# Altium schematic sheet ADC-Bessel-LPF.SchDoc: Bessel LPF / AAF (350kHz / 14dB)
size A4; Date: 06.10.2023; ApprovedBy: M.Sc. Tobias Wirth; CheckedBy: M.Sc. Tobias Wirth; Author: M.Sc. Tobias Wirth; CompanyName: University of Stuttgart; DrawnBy: M.Sc. Tobias Wirth; Engineer: M.Sc. Tobias Wirth; Organization: IIS; Address1: Pfaffenwaldring 47; Address2: 70569 Stuttgart; Revision: V1.3; SheetNumber: 11; SheetTotal: 17; ProjectNameAlt: AUS - NMR System; Time: 15:00; ImagePath: N/A; Application_BuildNumber: N/A
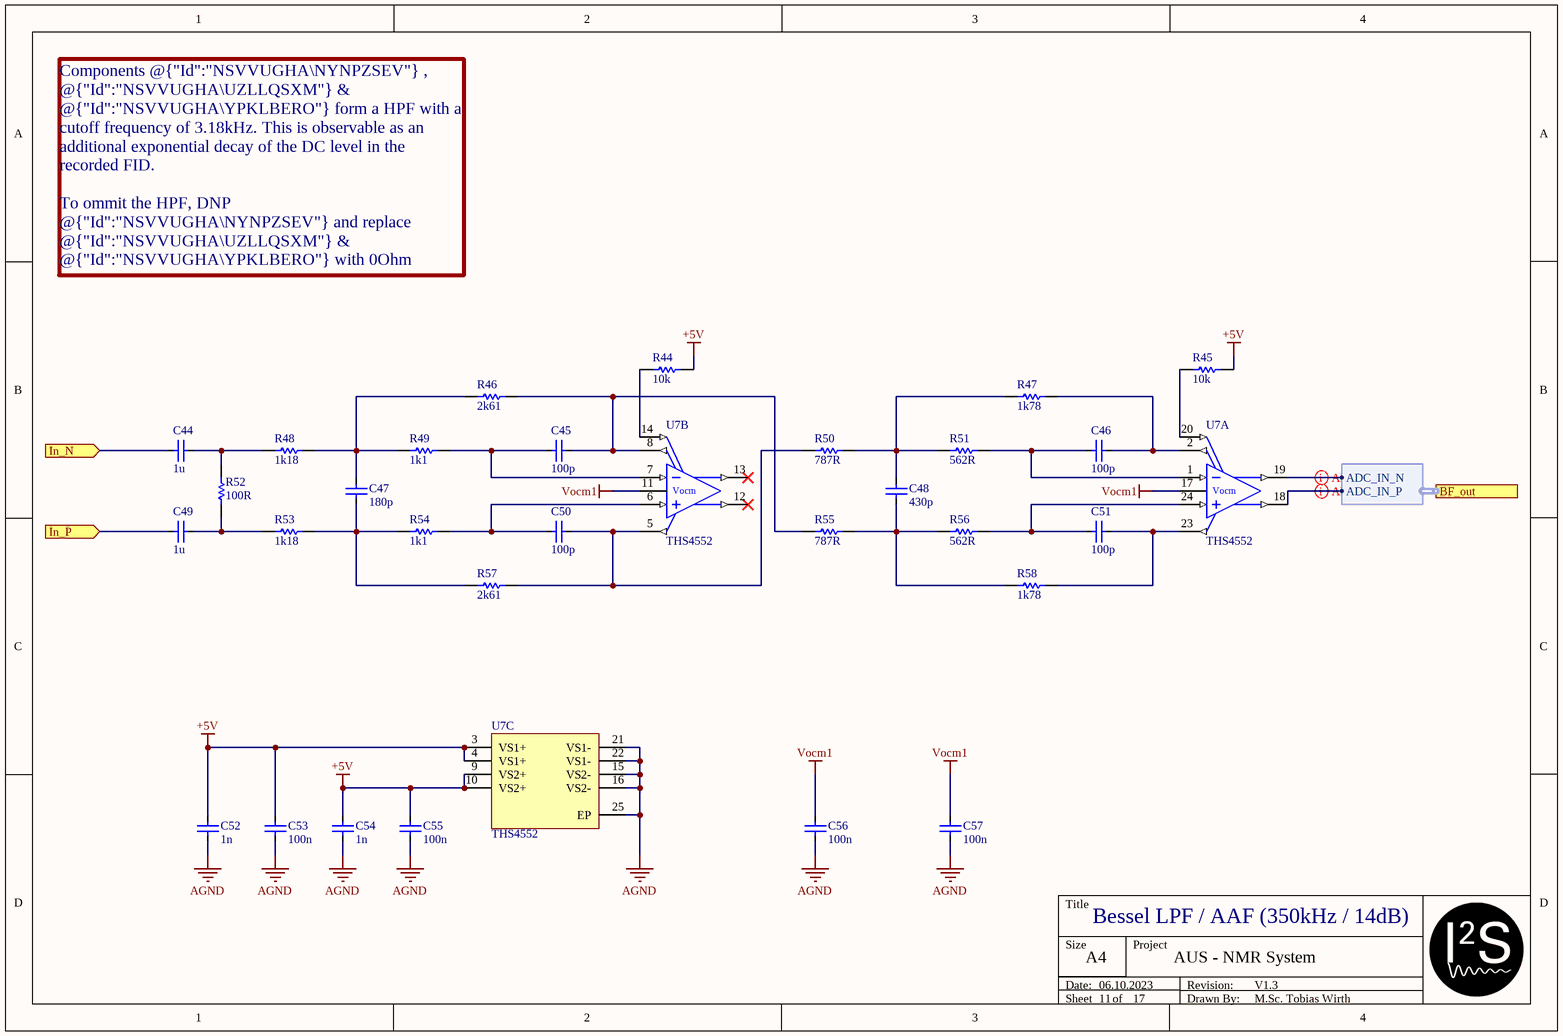
[diagram p0: ADC-Bessel-LPF.SchDoc]

## Parts
C44  1u  [CAP_0402]
C45  100p  [CAP_0402]
C46  100p  [CAP_0402]
C47  180p  [CAP_0402]
C48  430p  [CAP_0402]
C49  1u  [CAP_0402]
C50  100p  [CAP_0402]
C51  100p  [CAP_0402]
C52  1n  [CAP_0402]
C53  100n  [CAP_0402]
C54  1n  [CAP_0402]
C55  100n  [CAP_0402]
C56  100n  [CAP_0402]
C57  100n  [CAP_0402]
R44  10k  [RES_0402]
R45  10k  [RES_0402]
R46  2k61  [RES_0402]
R47  1k78  [RES_0402]
R48  1k18  [RES_0402]
R49  1k1  [RES_0402]
R50  787R  [RES_0402]
R51  562R  [RES_0402]
R52  100R  [RES_0402]
R53  1k18  [RES_0402]
R54  1k1  [RES_0402]
R55  787R  [RES_0402]
R56  562R  [RES_0402]
R57  2k61  [RES_0402]
R58  1k78  [RES_0402]
U7  THS4552  [QFN-24Pin_TP]  (parts A,B,C of 3)

## Ports
BF_out (harness ADC_IN), In_N (in), In_P (in)

## Harnesses
ADC_IN: ADC_IN_N, ADC_IN_P

## Nets
+5V: C52.1 C53.1 C54.1 C55.1 R44.2 R45.2 U7.3(VS1+) U7.4(VS1+) U7.9(VS2+) U7.10(VS2+)
AGND: C52.2 C53.2 C54.2 C55.2 C56.2 C57.2 U7.15(VS2-) U7.16(VS2-) U7.21(VS1-) U7.22(VS1-) U7.25(EP)
Vocm1: C56.1 C57.1 U7.11(VOCM2) U7.17(VOCM1)
In_N: C44.1 ; port In_N
In_P: C49.1 ; port In_P
NetC44_2: C44.2 R48.1 R52.2
NetC45_1: C45.1 R46.2 R55.1 U7.8(FB2+)
NetC45_2: C45.2 R49.2 U7.7(IN2-)
NetC46_1: C46.1 R47.2 U7.2(FB1+)
NetC46_2: C46.2 R51.2 U7.1(IN1-)
NetC47_1: C47.1 R46.1 R48.2 R49.1
NetC47_2: C47.2 R53.2 R54.1 R57.1
NetC48_1: C48.1 R47.1 R50.2 R51.1
NetC48_2: C48.2 R55.2 R56.1 R58.1
NetC49_2: C49.2 R52.1 R53.1
NetC50_1: C50.1 R50.1 R57.2 U7.5(FB2-)
NetC50_2: C50.2 R54.2 U7.6(IN2+)
NetC51_1: C51.1 R58.2 U7.23(FB1-)
NetC51_2: C51.2 R56.2 U7.24(IN1+)
NetR44_1: R44.1 U7.14(~{PD2})
NetR45_1: R45.1 U7.20(~{PD1})
NetU7_18: U7.18(OUT1+) ; port BF_out.ADC_IN_P
NetU7_19: U7.19(OUT1-) ; port BF_out.ADC_IN_N

Not connected (* = marked no-connect by the designer): U7 12(OUT2+)* 13(OUT2-)*

## Layout directives
differential pair; net class ADC_A_IN: NetU7_18, NetU7_19

## Notes on the sheet
- Components @{"Id":"NSVVUGHA\NYNPZSEV"} , @{"Id":"NSVVUGHA\UZLLQSXM"} & @{"Id":"NSVVUGHA\YPKLBERO"} form a HPF with a cutoff frequency of 3.18kHz. This is observable as an additional exponential decay of the DC level in the recorded FID.
  To ommit the HPF, DNP @{"Id":"NSVVUGHA\NYNPZSEV"} and replace @{"Id":"NSVVUGHA\UZLLQSXM"} & @{"Id":"NSVVUGHA\YPKLBERO"} with 0Ohm resistors.
  Not applicable in combinatiton with LFNMR Gen4 (HB's ASIC) due to its high DC output level. Ommiting the AC coupling / DC block will oversaturate the LPF!
- Title
- Size
- Date:
- Sheet
- A4
- of
- Project
- Drawn By:
- Revision:
- (in symbol THS4552, part A) Vocm
- (in symbol THS4552, part B) Vocm

## Library data of the parts
C44-C57 = Cap: Supplier: *; Part Number: *
  C44 C49: Value: 1u
  C45 C46 C50 C51: Value: 100p
  C47: Value: 180p
  C48: Value: 430p
  C52 C54: Value: 1n
  C53 C55-C57: Value: 100n
R44-R58 = Res: Part Number: *; Supplier: *
  R44 R45: Value: 10k
  R46 R57: Value: 2k61
  R47 R58: Value: 1k78
  R48 R53: Value: 1k18
  R49 R54: Value: 1k1
  R50 R55: Value: 787R
  R51 R56: Value: 562R
  R52: Value: 100R
U7 = THS4552: Dual-Channel, Low-Noise, Precision, 150-MHz, Fully Differential Amplifier; Manufacturer_Name: Texas Instruments; Manufacturer_Part_Number: THS4552IRTWT; Datasheet Link: http://www.ti.com/lit/gpn/THS4552; Height: 0.8mm; Mouser2 Part Number: 595-THS4552IRTWT; Mouser2 Price/Stock: https://www.mouser.com/Search/Refine.aspx?Keyword=595-THS4552IRTWT; Supplier 1: Digi-Key; Supplier Part Number 1: 296-51649-1-ND